# Altium schematic sheet PWR_CORE.SchDoc
size 420 x 297 mm; Scale: 1:1; DocumentType: Схема электрическая принципиальная; SheetNumber: 6; SheetTotal: 31; DocumentTypeShort: Э3; DocumentInvertoryNumber: ㅤ
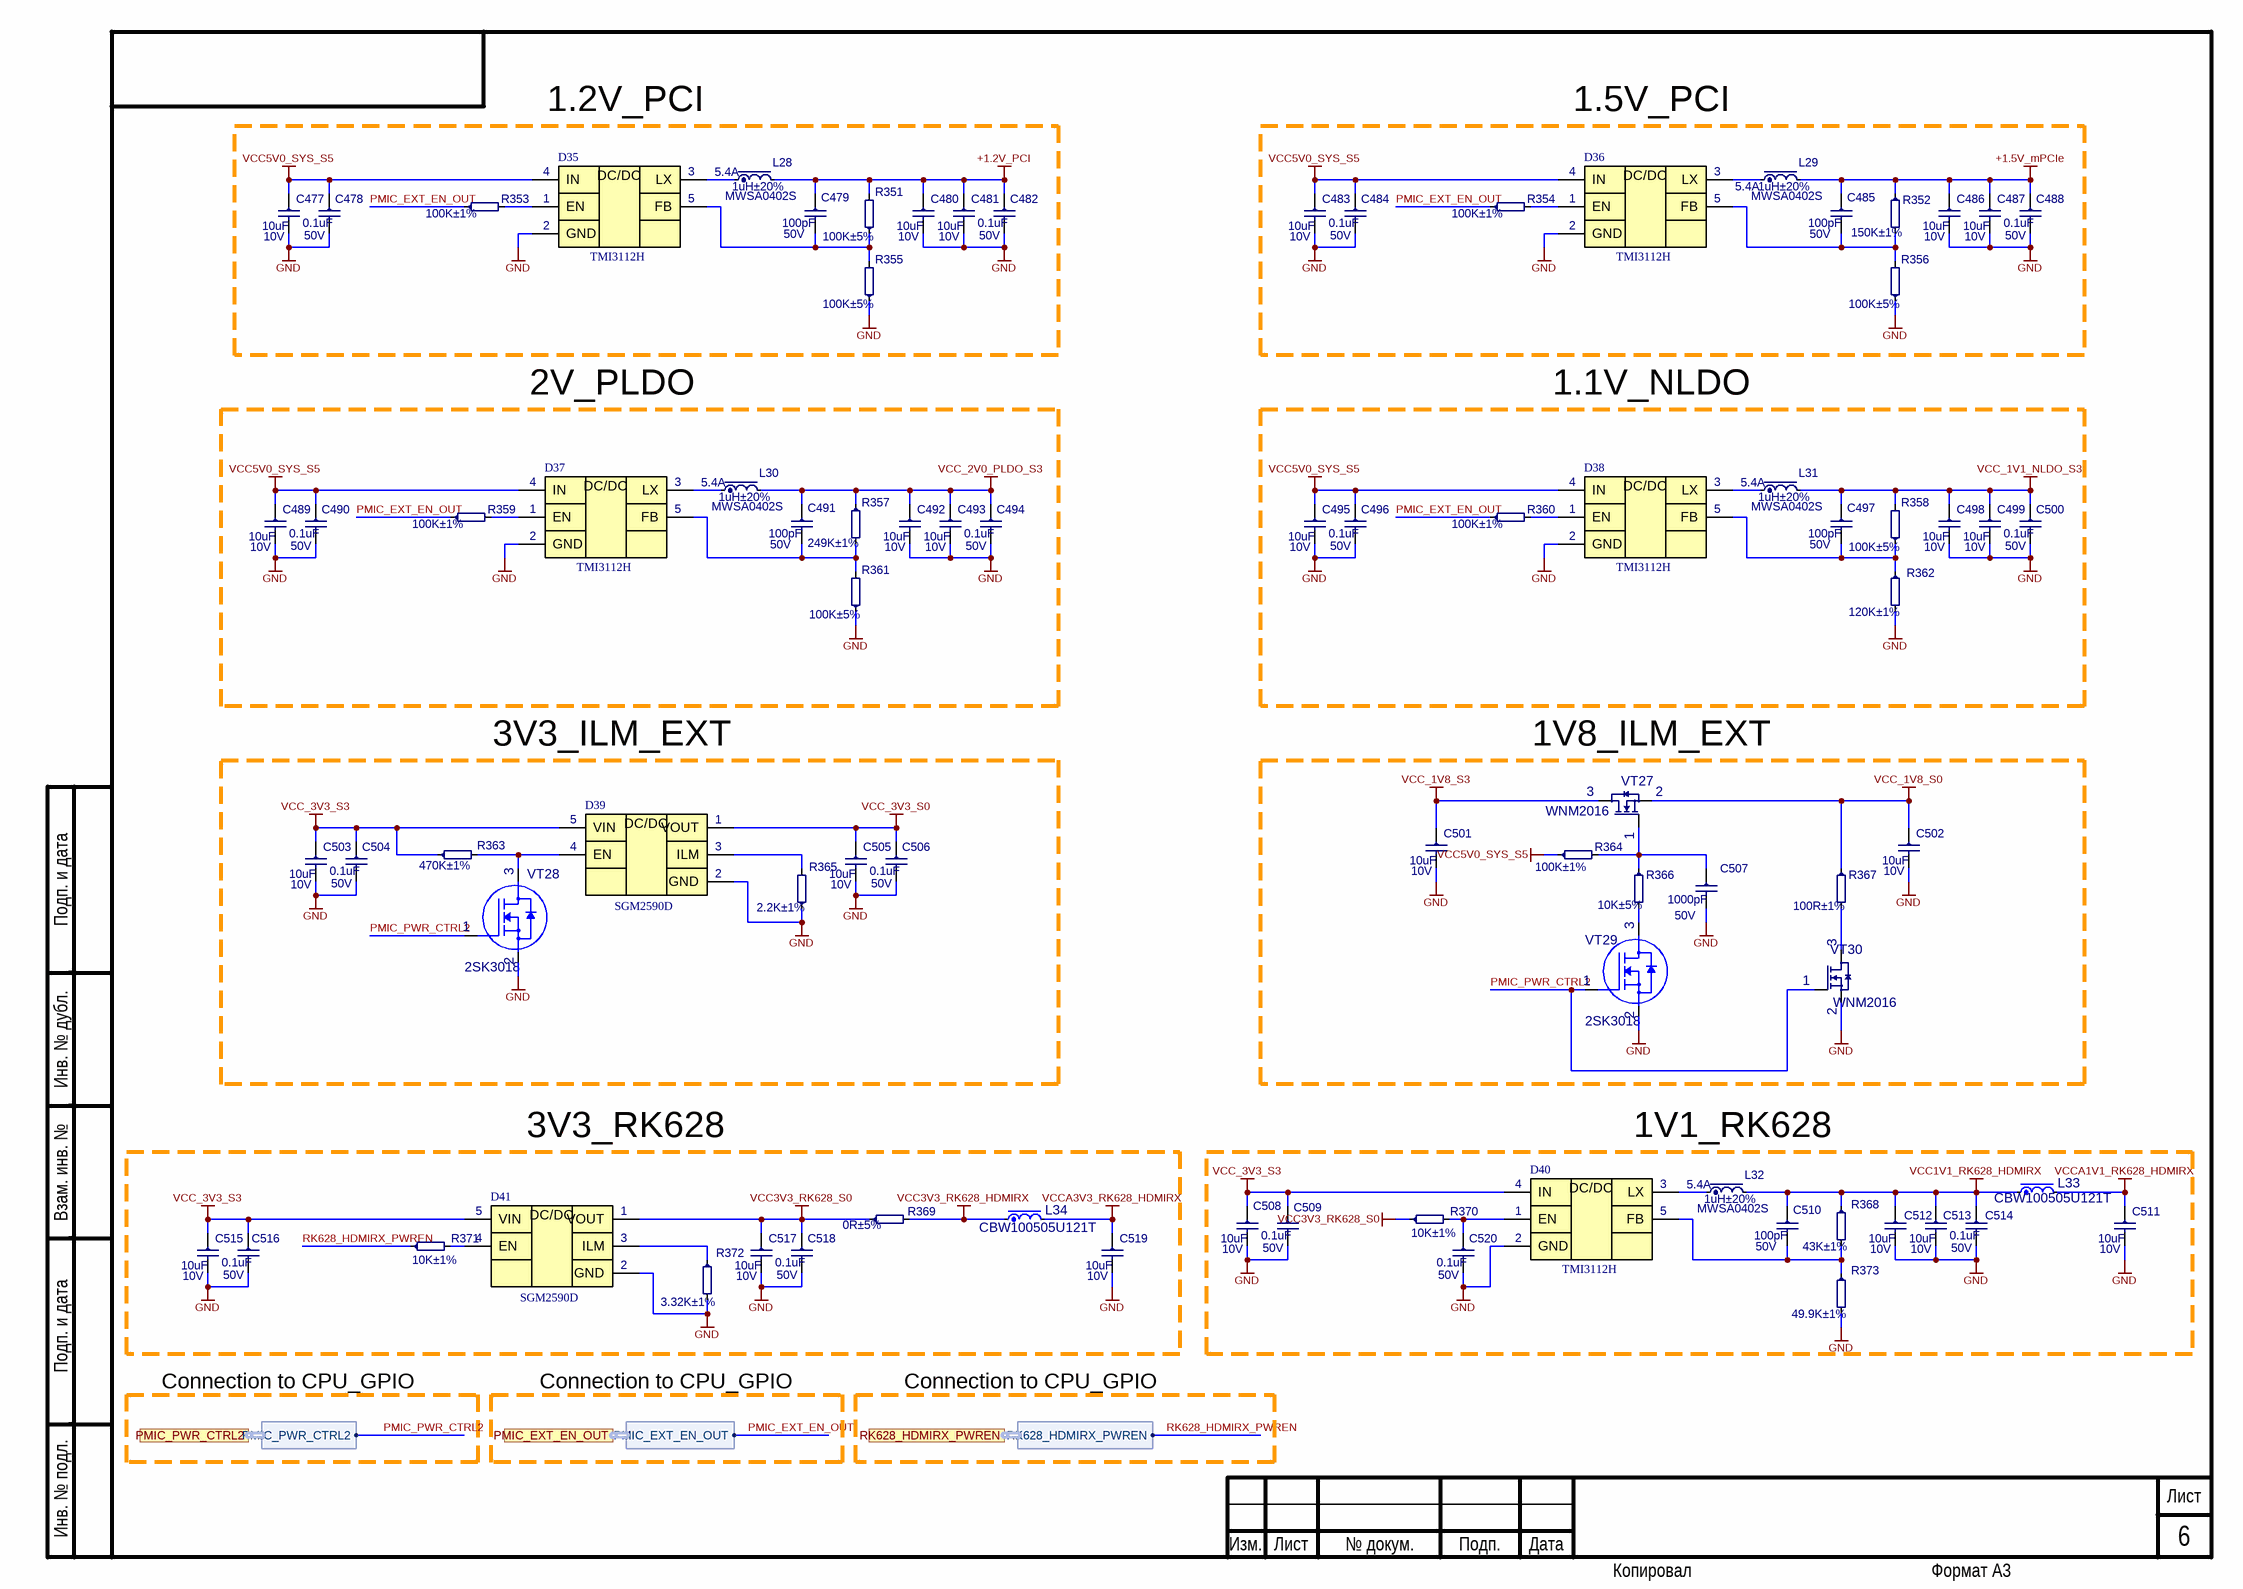
[diagram p0: PWR_CORE.SchDoc]

## Parts
C477  10uF  Voltage: 10V  [C0603]
C478  0.1uF  Voltage: 50V  [C0402]
C479  100pF  Voltage: 50V  [C0402]
C480  10uF  Voltage: 10V  [C0603]
C481  10uF  Voltage: 10V  [C0603]
C482  0.1uF  Voltage: 50V  [C0402]
C483  10uF  Voltage: 10V  [C0603]
C484  0.1uF  Voltage: 50V  [C0402]
C485  100pF  Voltage: 50V  [C0402]
C486  10uF  Voltage: 10V  [C0603]
C487  10uF  Voltage: 10V  [C0603]
C488  0.1uF  Voltage: 50V  [C0402]
C489  10uF  Voltage: 10V  [C0603]
C490  0.1uF  Voltage: 50V  [C0402]
C491  100pF  Voltage: 50V  [C0402]
C492  10uF  Voltage: 10V  [C0603]
C493  10uF  Voltage: 10V  [C0603]
C494  0.1uF  Voltage: 50V  [C0402]
C495  10uF  Voltage: 10V  [C0603]
C496  0.1uF  Voltage: 50V  [C0402]
C497  100pF  Voltage: 50V  [C0402]
C498  10uF  Voltage: 10V  [C0603]
C499  10uF  Voltage: 10V  [C0603]
C500  0.1uF  Voltage: 50V  [C0402]
C501  10uF  Voltage: 10V  [C0603]
C502  10uF  Voltage: 10V  [C0603]
C503  10uF  Voltage: 10V  [C0603]
C504  0.1uF  Voltage: 50V  [C0402]
C505  10uF  Voltage: 10V  [C0603]
C506  0.1uF  Voltage: 50V  [C0402]
C507  1000pF  Voltage: 50V  [C0402]
C508  10uF  Voltage: 10V  [C0603]
C509  0.1uF  Voltage: 50V  [C0402]
C510  100pF  Voltage: 50V  [C0402]
C511  10uF  Voltage: 10V  [C0603]
C512  10uF  Voltage: 10V  [C0603]
C513  10uF  Voltage: 10V  [C0603]
C514  0.1uF  Voltage: 50V  [C0402]
C515  10uF  Voltage: 10V  [C0603]
C516  0.1uF  Voltage: 50V  [C0402]
C517  10uF  Voltage: 10V  [C0603]
C518  0.1uF  Voltage: 50V  [C0402]
C519  10uF  Voltage: 10V  [C0603]
C520  0.1uF  Voltage: 50V  [C0402]
D35  TMI3112H  [TMI3112H]
D36  TMI3112H  [TMI3112H]
D37  TMI3112H  [TMI3112H]
D38  TMI3112H  [TMI3112H]
D39  SGM2590D  [SGM2590D]
D40  TMI3112H  [TMI3112H]
D41  SGM2590D  [SGM2590D]
L28  1uH±20%  Current: 5.4A  [MWSA0402S]
L29  1uH±20%  Current: 5.4A  [MWSA0402S]
L30  1uH±20%  Current: 5.4A  [MWSA0402S]
L31  1uH±20%  Current: 5.4A  [MWSA0402S]
L32  1uH±20%  Current: 5.4A  [MWSA0402S]
L33  CBW100505U121T  [L0402]
L34  CBW100505U121T  [L0402]
R351  100K±5%  [R0402]
R352  150K±1%  [R0402]
R353  100K±1%  [R0402]
R354  100K±1%  [R0402]
R355  100K±5%  [R0402]
R356  100K±5%  [R0402]
R357  249K±1%  [R0402]
R358  100K±5%  [R0402]
R359  100K±1%  [R0402]
R360  100K±1%  [R0402]
R361  100K±5%  [R0402]
R362  120K±1%  [R0402]
R363  470K±1%  [R0402]
R364  100K±1%  [R0402]
R365  2.2K±1%  [R0402]
R366  10K±5%  [R0402]
R367  100R±1%  [R0402]
R368  43K±1%  [R0402]
R369  0R±5%  [R0603]
R370  10K±1%  [R0402]
R371  10K±1%  [R0402]
R372  3.32K±1%  [R0603]
R373  49.9K±1%  [R0402]
VT27  WNM2016  [SOT23]
VT28  2SK3018  [2SK3018]
VT29  2SK3018  [2SK3018]
VT30  WNM2016  [SOT23]

## Ports
PMIC_EXT_EN_OUT (harness PMIC_EXT_EN_OUT), PMIC_PWR_CTRL2 (harness PMIC_PWR_CTRL2), RK628_HDMIRX_PWREN (harness RK628_HDMIRX_PWREN)

## Harnesses
PMIC_PWR_CTRL2: PMIC_PWR_CTRL2
PMIC_EXT_EN_OUT: PMIC_EXT_EN_OUT
RK628_HDMIRX_PWREN: RK628_HDMIRX_PWREN

## Nets
+1.2V_PCI: C479.1 C480.1 C481.1 C482.1 L28.2 R351.2
+1.5V_mPCIe: C485.1 C486.1 C487.1 C488.1 L29.2 R352.1
GND: C477.2 C478.2 C480.2 C481.2 C482.2 C483.2 C484.2 C486.2 C487.2 C488.2 C489.2 C490.2 C492.2 C493.2 C494.2 C495.2 C496.2 C498.2 C499.2 C500.2 C501.2 C502.2 C503.2 C504.2 C505.2 C506.2 C507.2 C508.2 C509.2 C511.2 C512.2 C513.2 C514.2 C515.2 C516.2 C517.2 C518.2 C519.2 C520.2 D35.2(GND) D36.2(GND) D37.2(GND) D38.2(GND) D39.2(GND) D40.2(GND) D41.2(GND) R355.1 R356.1 R361.1 R362.2 R365.1 R372.2 R373.2 VT28.2(S) VT29.2(S) VT30.2(S)
VCC1V1_RK628_HDMIRX: C510.1 C512.1 C513.1 C514.1 L32.2 L33.1 R368.1
VCC3V3_RK628_HDMIRX: L34.1 R369.2
VCC3V3_RK628_S0: C517.1 C518.1 D41.1(VOUT) R369.1 R370.1
VCC5V0_SYS_S5: C477.1 C478.1 C483.1 C484.1 C489.1 C490.1 C495.1 C496.1 D35.4(IN) D36.4(IN) D37.4(IN) D38.4(IN) R364.1
VCC_1V1_NLDO_S3: C497.1 C498.1 C499.1 C500.1 L31.2 R358.2
VCC_1V8_S0: C502.1 R367.1 VT27.2(S)
VCC_1V8_S3: C501.1 VT27.3(D)
VCC_2V0_PLDO_S3: C491.1 C492.1 C493.1 C494.1 L30.2 R357.1
VCC_3V3_S0: C505.1 C506.1 D39.1(VOUT)
VCC_3V3_S3: C503.1 C504.1 C508.1 C509.1 C515.1 C516.1 D39.5(VIN) D40.4(IN) D41.5(VIN) R363.1
VCCA1V1_RK628_HDMIRX: C511.1 L33.2
VCCA3V3_RK628_HDMIRX: C519.1 L34.2
PMIC_EXT_EN_OUT: R353.1 R354.1 R359.1 R360.1 ; port PMIC_EXT_EN_OUT.PMIC_EXT_EN_OUT
PMIC_PWR_CTRL2: VT28.1(G) VT29.1(G) VT30.1(G) ; port PMIC_PWR_CTRL2.PMIC_PWR_CTRL2
RK628_HDMIRX_PWREN: R371.1 ; port RK628_HDMIRX_PWREN.RK628_HDMIRX_PWREN
NetC479_2: C479.2 D35.5(FB) R351.1 R355.2
NetC485_2: C485.2 D36.5(FB) R352.2 R356.2
NetC491_2: C491.2 D37.5(FB) R357.2 R361.2
NetC497_2: C497.2 D38.5(FB) R358.1 R362.1
NetC507_1: C507.1 R364.2 R366.1 VT27.1(G)
NetC510_2: C510.2 D40.5(FB) R368.2 R373.1
NetC520_1: C520.1 D40.1(EN) R370.2
NetD35_1: D35.1(EN) R353.2
NetD35_3: D35.3(LX) L28.1
NetD36_1: D36.1(EN) R354.2
NetD36_3: D36.3(LX) L29.1
NetD37_1: D37.1(EN) R359.2
NetD37_3: D37.3(LX) L30.1
NetD38_1: D38.1(EN) R360.2
NetD38_3: D38.3(LX) L31.1
NetD39_3: D39.3(ILM) R365.2
NetD39_4: D39.4(EN) R363.2 VT28.3(D)
NetD40_3: D40.3(LX) L32.1
NetD41_3: D41.3(ILM) R372.1
NetD41_4: D41.4(EN) R371.2
NetR366_2: R366.2 VT29.3(D)
NetR367_2: R367.2 VT30.3(D)

## Notes on the sheet
- 1.2V_PCI
- 1.5V_PCI
- 2V_PLDO
- 1.1V_NLDO
- 3V3_ILM_EXT
- (near VT27) 1V8_ILM_EXT
- 3V3_RK628
- 1V1_RK628
- Connection to CPU_GPIO
- Подп. и дата
- Инв. № дубл.
- Взам. инв. №
- Инв. № подл.
- Изм.
- Лист
- № докум.
- Подп.
- Дата
- Копировал
- Формат А3
- (in symbol SGM2590D) DC/DC
- (in symbol TMI3112H) DC/DC

## Library data of the parts
C477 C480 C481 C483 C486 C487 C489 C492 C493 C495 C498 C499 C501-C503 C505 C508 C511-C513 C515 C517 C519 = 0603-X5R-10V-10uF±10%: *; Manufacturer: Yageo; NameFromManufacturer: CC0603KRX5R6BB106; Dielectric: X5R; Place: *); Tolerance: 10%; Check: False; Case: C0603; Part Number: 0603-X5R-10V-10uF±10%; Value: 10uF; Temperature: -55°C~85°C; ComponentLink2Description: Link to datasheet; ComponentLink1Description: DATASHEET; ComponentLink2URL: https://www.yageo.com/upload/media/product/productsearch/datasheet/mlcc/UPY-GPHC_X5R_4V-to-50V_26.pdf; ComponentLink1URL: Datasheets/capacitors/UPY-GPHC_X5R_4V-to-50V_26.pdf; Last changed: 27.10.2022
C478 C482 C484 C488 C490 C494 C496 C500 C504 C506 C509 C514 C516 C518 C520 = 0402-X5R-50V-0.1uF±10%: Manufacturer: Yageo; NameFromManufacturer: CC0402KRX5R9BB104; Dielectric: X5R; Place: *); Tolerance: 10%; Check: False; Case: C0402; Part Number: 0402-X5R-50V-0.1uF±10%; Value: 0.1uF; Temperature: -55°C~85°C; ComponentLink2Description: Link to datasheet; ComponentLink1Description: DATASHEET; ComponentLink2URL: https://www.yageo.com/upload/media/product/productsearch/datasheet/mlcc/UPY-GPHC_X5R_4V-to-50V_26.pdf; ComponentLink1URL: Datasheets/capacitors/UPY-GPHC_X5R_4V-to-50V_26.pdf; Last changed: 27.10.2022
C479 C485 C491 C497 C510 = 0402-NP0-50V-100pF±5%: *; Manufacturer: Yageo; NameFromManufacturer: CC0402JRNPO9BN101; Dielectric: NP0; Place: *); Tolerance: 5%; Check: False; Case: C0402; Part Number: 0402-NP0-50V-100pF±5%; Value: 100pF; Temperature: -55°C~125°C; ComponentLink2Description: Link to datasheet; ComponentLink1Description: DATASHEET; ComponentLink2URL: https://www.terraelectronica.ru/product/367375; ComponentLink1URL: Datasheets/capacitors/UPY-GP_NP0_16V-to-50V_18.pdf; Last changed: 27.10.2022
C507 = 0402-NP0-50V-1000pF±5%: Manufacturer: Yageo; NameFromManufacturer: CC0402JRNPO9BN102; Dielectric: NP0; Place: *); Tolerance: 5%; Check: False; Case: C0402; Part Number: 0402-NP0-50V-1000pF±5%; Value: 1000pF; Temperature: -55°C~125°C; ComponentLink2Description: Link to datasheet; ComponentLink1Description: DATASHEET; ComponentLink2URL: https://www.terraelectronica.ru/product/2101763; ComponentLink1URL: Datasheets/capacitors/UPY-GP_NP0_16V-to-50V_18.pdf; Last changed: 27.10.2022
D35-D38 D40 = TMI3112H: Buck 2.3MHz Adjustable 2A 600mV~5.5V SOT-23-5 Voltage Regulators - DC DC Switching Regulators RoHS; Manufacturer: TMI; Check: False; Part Number: TMI3112H; NameFromManufacturer: TMI3112H; Value: TMI3112H
D39 D41 = SGM2590D: Manufacturer: SGM; Check: False; Part Number: SGM2590D; NameFromManufacturer: SGM2590D; Value: SGM2590D
L28-L32 = MWSA0402S-1R0MT: 5.4A 1uH ±20% 5.6A SMD 4.4x4.2mm Power Inductor; Manufacturer: Sunlord; Place: *); DC Resistance: 0.27; Check: False; Case: MWSA0402S; Part Number: MWSA0402S-1R0MT; Value: 1uH; Tolerance: 20%; Temperature: -40°C~125°C; ComponentLink1Description: DATASHEET; NameFromManufacturer: MWSA0402S-1R0MT; ComponentLink1URL: https://www.electronshik.ru/item/SUNLORD/MWSA0402S-1R0MT; Last changed: 22.04.2025
L33 L34 = BLM15EG121SN1D: 120Ω@100MHz  Ferrite Beads; Manufacturer: Murata Electronics; Place: S; Tolerance: 25%; DC Resistance: 0.095R; Check: False; Analog: UPZ1005D121-1R3TF, CBW100505U121T, BLM15EG121SN1D; Part Number: CBW100505U121T; Value: CBW100505U121T; Temperature: -40°C~85°C; NameFromManufacturer: CBW100505U121T; Last changed: 18.04.2023
R351 R355 R356 R358 R361 = 0402-0.0625W-100K-100ppm±5%: NameFromManufacturer: RC0402JR-07100KL; Manufacturer: Yageo; Place: *); Value: 100K; Tolerance: 5%; Check: False; Case: R0402; Part Number: 0402-0.0625W-100K-100ppm±5%; Temperature: -55°C~155°C; ComponentLink1Description: DATASHEET; ComponentLink1URL: https://ru.mouser.com/ProductDetail/YAGEO/RC0402JR-07100KL?qs=%2Fha2pyFadugNN0LzwXn2qCsICuw6vgLBeLL%252BmXUKy2OLGS9kgqrNBA%3D%3D; Datasheet: Datasheets/resistors/PYu-RC_Group_51_RoHS_L_11.pdf; Last changed: 27.10.2022
R352 = 0402-0.0625W-150K-100ppm±1%: NameFromManufacturer: RC0402FR-07150KL; Manufacturer: Yageo; Place: *); Value: 150K; Tolerance: 1%; Check: False; Case: R0402; Part Number: 0402-0.0625W-150K-100ppm±1%; Temperature: -55°C~155°C; ComponentLink1Description: DATASHEET; ComponentLink1URL: https://www.yageo.com/upload/media/product/productsearch/datasheet/rchip/PYu-RC_Group_51_RoHS_L_11.pdf; Datasheet: Datasheets/resistors/PYu-RC_Group_51_RoHS_L_11.pdf; Last changed: 27.10.2022
R353 R354 R359 R360 R364 = 0402-0.0625W-100K-100ppm±1%: Chip Resistor 0402 100kΩ ±1% 50V ±100ppm/℃ Thick Film; NameFromManufacturer: RC0402FR-07100KL; Manufacturer: Yageo; Place: *); Value: 100K; Check: False; Case: R0402; Part Number: 0402-0.0625W-100K-100ppm±1%; Tolerance: 1%; Temperature: -55°C~155°C; ComponentLink1Description: DATASHEET; ComponentLink1URL: https://www.yageo.com/upload/media/product/productsearch/datasheet/rchip/PYu-RC_Group_51_RoHS_L_11.pdf; Datasheet: Datasheets/resistors/PYu-RC_Group_51_RoHS_L_11.pdf; Last changed: 27.10.2022
R357 = 0402-0.0625W-249K-100ppm±1%: NameFromManufacturer: RC0402FR-07249KL; Manufacturer: Yageo; Place: *); Value: 249K; Tolerance: 1%; Check: False; Case: R0402; Part Number: 0402-0.0625W-249K-100ppm±1%; Temperature: -55°C~155°C; ComponentLink1Description: DATASHEET; ComponentLink1URL: https://lcsc.com/product-detail/Chip-Resistor-Surface-Mount_YAGEO-RC0402FR-07249KL_C163476.html; Datasheet: Datasheets/resistors/PYu-RC_Group_51_RoHS_L_12.pdf#Datasheets/resistors/PYu-RC_Group_51_RoHS_L_12.pdf#; Last changed: 09.11.2022
R362 = 0402-0.0625W-120K-100ppm±1%: NameFromManufacturer: RC0402FR-07120KL; Manufacturer: Yageo; Place: *); Value: 120K; Tolerance: 1%; Check: False; Case: R0402; Part Number: 0402-0.0625W-120K-100ppm±1%; Temperature: -55°C~155°C; ComponentLink1Description: DATASHEET; ComponentLink1URL: https://eu.mouser.com/ProductDetail/YAGEO/RC0402FR-07120KL?qs=sxZXDnvRBEiD8SsZ%252BM9D1g%3D%3D; Datasheet: Datasheets/resistors/PYu-RC_Group_51_RoHS_L_11.pdf; Last changed: 27.10.2022
R363 = 0402-0.0625W-470K-100ppm±1%: *; NameFromManufacturer: RC0402FR-07470KL; Manufacturer: Yageo; Place: *); Value: 470K; Tolerance: 1%; Check: False; Case: R0402; Part Number: 0402-0.0625W-470K-100ppm±1%; Temperature: -55°C~155°C; ComponentLink1Description: DATASHEET; ComponentLink1URL: https://www.digikey.com/en/products/detail/yageo/RC0402FR-07470KL/726618?s=N4IgTCBcDaIEoGEAMAWJYBicC0SDsKeSA0gDIgC6AvkA; Datasheet: Datasheets/resistors/PYu-RC_Group_51_RoHS_L_11.pdf; Last changed: 27.10.2022
R365 = 0402-0.0625W-2.2K-100ppm±1%: *; NameFromManufacturer: RC0402FR-072K2L; Manufacturer: Yageo; Place: *); Value: 2.2K; Tolerance: 1%; Check: False; Case: R0402; Part Number: 0402-0.0625W-2.2K-100ppm±1%; Temperature: -55°C~155°C; ComponentLink1Description: DATASHEET; ComponentLink1URL: https://www.compel.ru/infosheet/YAG/SR0402FR-072K2L; Datasheet: Datasheets/resistors/PYu-SR_D_F tol_RoHS_L_5.pdf; Last changed: 27.10.2022
R366 = 0402-0.0625W-10K-100ppm±5%: NameFromManufacturer: RC0402JR-0710KL; Manufacturer: Yageo; Place: *); Value: 10K; Tolerance: 5%; Check: False; Case: R0402; Part Number: 0402-0.0625W-10K-100ppm±5%; Temperature: -55°C~155°C; ComponentLink1Description: DATASHEET; ComponentLink1URL: https://ru.mouser.com/ProductDetail/YAGEO/RC0402JR-0710KL?qs=%2Fha2pyFadugNN0LzwXn2qF8HRAp201xOpXu%252BapQnyvRGE%2F%252Bpr1TWjQ%3D%3D; Datasheet: Datasheets/resistors/PYu-RC_Group_51_RoHS_L_11.pdf; Last changed: 27.10.2022
R367 = 0402-0.0625W-100R-100ppm±1%: Chip Resistor 0402 100Ω ±1% 50V ±100ppm/℃ Thick Film; NameFromManufacturer: RC0402FR-07100RL; Manufacturer: Yageo; Place: *); Value: 100R; Check: False; Case: R0402; Part Number: 0402-0.0625W-100R-100ppm±1%; Tolerance: 1%; Temperature: -55°C~155°C; ComponentLink1Description: DATASHEET; ComponentLink1URL: https://www.yageo.com/upload/media/product/productsearch/datasheet/rchip/PYu-RC_Group_51_RoHS_L_11.pdf; Datasheet: Datasheets/resistors/PYu-RC_Group_51_RoHS_L_11.pdf; Last changed: 27.10.2022
R368 = 0402-0.0625W-43K-100ppm±1%: NameFromManufacturer: RC0402FR-0743KL; Manufacturer: Yageo; Place: *); Value: 43K; Tolerance: 1%; Check: False; Case: R0402; Part Number: 0402-0.0625W-43K-100ppm±1%; Temperature: -55°C~155°C; ComponentLink1Description: DATASHEET; ComponentLink1URL: https://www.compel.ru/infosheet/YAG/RC0402FR-0743KL; Datasheet: Datasheets/resistors/PYu-RC_Group_51_RoHS_L_11.pdf; Last changed: 27.10.2022
R369 = 0603-0.1W-0R-100ppm±5%: Chip Resistor 0603 0Ω ±5% 50V ±100ppm/℃ Thick Film; NameFromManufacturer: RC0603JR-070RL; Manufacturer: Yageo; Place: *); Value: 0R; Check: False; Case: R0603; Part Number: 0603-0.1W-0R-100ppm±5%; Tolerance: 5%; Temperature: -55°C~155°C; ComponentLink1Description: DATASHEET; ComponentLink1URL: https://www.chipdip.ru/product/0.1w-0603-0-om-5; Datasheet: Datasheets/resistors/PYu-RC_Group_51_RoHS_L_11.pdf; Last changed: 27.10.2022
R370 R371 = 0402-0.0625W-10K-100ppm±1%: Chip Resistor 0402 10kΩ ±1% 50V ±100ppm/℃ Thick Film; NameFromManufacturer: RC0402FR-0710KL; Manufacturer: Yageo; Place: *); Value: 10K; Check: False; Case: R0402; Part Number: 0402-0.0625W-10K-100ppm±1%; Tolerance: 1%; Temperature: -55°C~155°C; ComponentLink1Description: DATASHEET; ComponentLink1URL: https://ru.mouser.com/ProductDetail/YAGEO/RC0402FR-0710KL?qs=%2Fha2pyFaduhjtLcYvKXQ8IogF7YwN7YtH%252BOO8ZtEEMnoa4yoWYcwpw%3D%3D; Datasheet: Datasheets/resistors/PYu-RC_Group_51_RoHS_L_11.pdf; Last changed: 27.10.2022
R372 = 0603-0.1W-3.32K-100ppm±1%: NameFromManufacturer: CR-03FL7---3K3; Manufacturer: Viking Tech Corp.(VIKING); Place: *); Value: 3.32K; Tolerance: 1%; Check: False; Case: R0603; Part Number: 0603-0.1W-3.32K-100ppm±1%; Temperature: -55°C~155°C; ComponentLink1Description: DATASHEET; ComponentLink1URL: https://www.terraelectronica.ru/product/2782044; Datasheet: Datasheets/resistors/CR_SERIES.pdf; Last changed: 27.10.2022
R373 = 0402-0.0625W-49.9K-100ppm±1%: Chip Resistor 0402 49.9kΩ ±1% 50V ±100ppm/℃ Thick Film; NameFromManufacturer: RC0402FR-0749K9L; Manufacturer: Yageo; Place: *); Value: 49.9K; Check: False; Case: R0402; Part Number: 0402-0.0625W-49.9K-100ppm±1%; Tolerance: 1%; Temperature: -55°C~155°C; ComponentLink1Description: DATASHEET; ComponentLink1URL: https://www.terraelectronica.ru/product/562862; Datasheet: Datasheets/resistors/PYu-RC_Group_51_RoHS_L_11.pdf; Last changed: 27.10.2022
VT27 VT30 = 2N7002,215: 60V 3A 0.35W Surface Mount SOT-23; Manufacturer: KUU Semiconductor; Place: *); Check: False; Part Number: WNM2016; Voltage: 60V; Value: WNM2016; Temperature: -65°C~150°C";; ComponentLink1Description: DATASHEET; NameFromManufacturer: WNM2016; ComponentLink1URL: https://assets.nexperia.com/documents/data-sheet/2N7002.pdf; Last changeв: 27.10.2022
VT28 VT29 = 2SK3018: N-Channel; Check: False; Part Number: 2SK3018; Value: 2SK3018; NameFromManufacturer: 2SK3018